# EAGLE design DAC_1_0 (EAGLE 7.6.0)
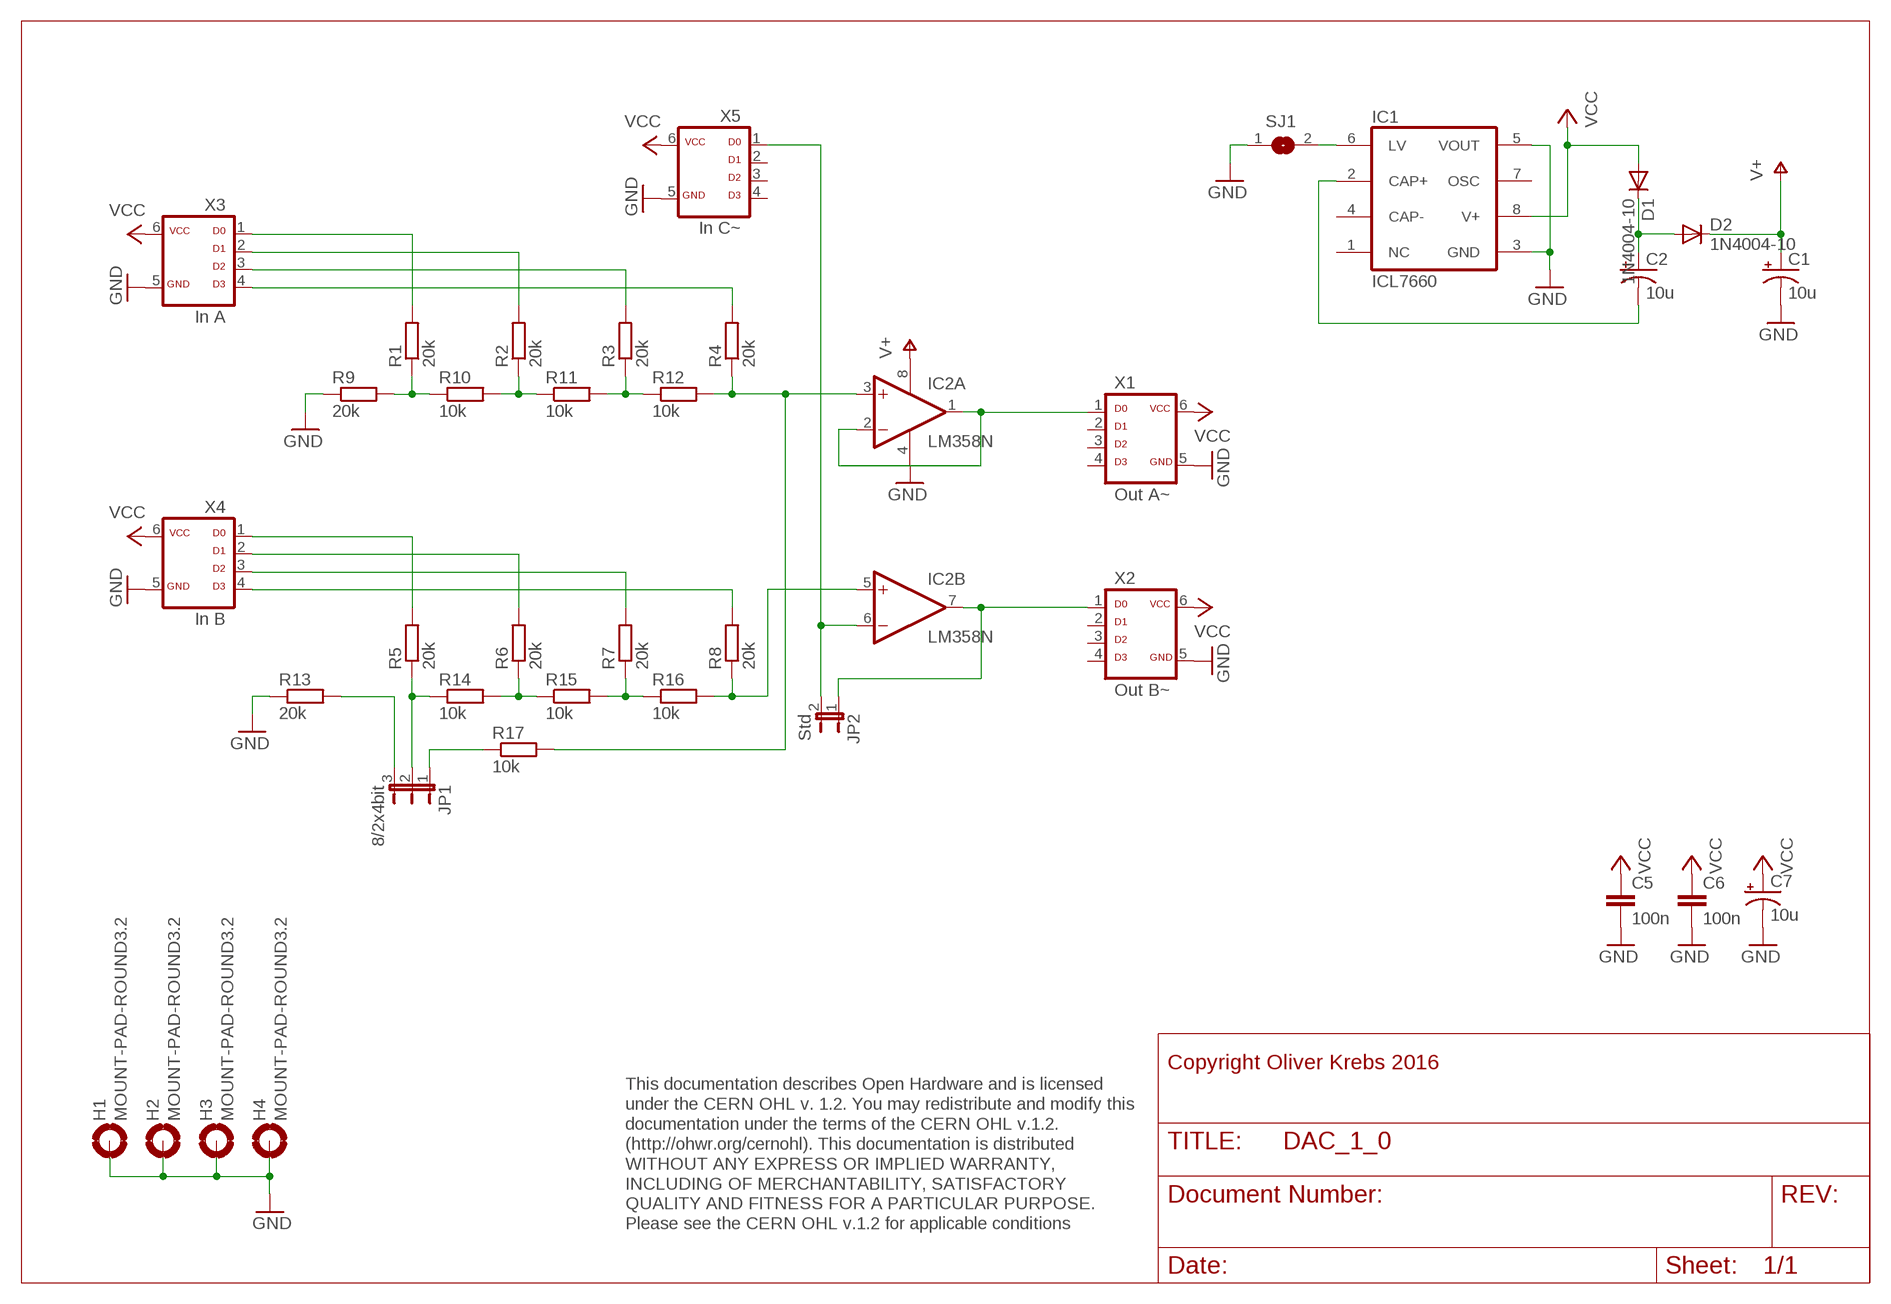
[diagram p0: schematic, sheet 1]

## Parts
C1  10u  CAP_POLPTH2  [CPOL-RADIAL-10UF-25V]
C2  10u  CAP_POLPTH2  [CPOL-RADIAL-10UF-25V]
C5  100n  CAPPTH1  [CAP-PTH-5MM]
C6  100n  CAPPTH1  [CAP-PTH-5MM]
C7  10u  CAP_POLPTH2  [CPOL-RADIAL-10UF-25V]
D1  1N4004-10  [DO41-10]
D2  1N4004-10  [DO41-10]
H1  MOUNT-PAD-ROUND3.2  [3,2-PAD]
H2  MOUNT-PAD-ROUND3.2  [3,2-PAD]
H3  MOUNT-PAD-ROUND3.2  [3,2-PAD]
H4  MOUNT-PAD-ROUND3.2  [3,2-PAD]
IC1  ICL7660  ICL7660CPA  [DIL08]
IC2  LM358N  [DIL08]
JP1  8/2x4bit  JP2EJP2-U  [JP2-U]
JP2  Std  JP1E  [JP1]
R1  20k  R-EU_0207/2V  [0207/2V]
R2  20k  R-EU_0207/2V  [0207/2V]
R3  20k  R-EU_0207/2V  [0207/2V]
R4  20k  R-EU_0207/2V  [0207/2V]
R5  20k  R-EU_0207/2V  [0207/2V]
R6  20k  R-EU_0207/2V  [0207/2V]
R7  20k  R-EU_0207/2V  [0207/2V]
R8  20k  R-EU_0207/2V  [0207/2V]
R9  20k  R-EU_0207/2V  [0207/2V]
R10  10k  R-EU_0207/2V  [0207/2V]
R11  10k  R-EU_0207/2V  [0207/2V]
R12  10k  R-EU_0207/2V  [0207/2V]
R13  20k  R-EU_0207/2V  [0207/2V]
R14  10k  R-EU_0207/2V  [0207/2V]
R15  10k  R-EU_0207/2V  [0207/2V]
R16  10k  R-EU_0207/2V  [0207/2V]
R17  10k  R-EU_0207/2V  [0207/2V]
SJ1  SJ  [SJ]
X1  Out A~  ML6D  [ML-6]
X2  Out B~  ML6D  [ML-6]
X3  In A  ML6D  [ML-6]
X4  In B  ML6D  [ML-6]
X5  In C~  ML6D  [ML-6]

## Nets
GND: C1.2(-) C5.2 C6.2 C7.2(-) H1.B3,2(MOUNT) H2.B3,2(MOUNT) H3.B3,2(MOUNT) H4.B3,2(MOUNT) IC1.3(GND) IC1.5(VOUT) IC2.4(P:V-) R9.1 R13.1 SJ1.1 X1.5 X2.5 X3.5 X4.5 X5.5
N$1: R1.2 X3.1
N$2: R2.2 X3.2
N$3: R3.2 X3.3
N$4: R4.2 X3.4
N$5: C2.2(-) IC1.2(CAP+)
N$6: C2.1(+) D1.C D2.A
N$7: R1.1 R9.2 R10.1
N$8: R2.1 R10.2 R11.1
N$9: R3.1 R11.2 R12.1
N$10: IC2.3(A:+IN) R4.1 R12.2 R17.2
N$11: R5.2 X4.1
N$12: R6.2 X4.2
N$13: R7.2 X4.3
N$14: R8.2 X4.4
N$15: JP1.2 R5.1 R14.1
N$16: R6.1 R14.2 R15.1
N$17: R7.1 R15.2 R16.1
N$18: IC2.5(B:+IN) R8.1 R16.2
N$19: JP1.3 R13.2
N$21: IC2.1(A:OUT) IC2.2(A:-IN) X1.1
N$22: IC2.7(B:OUT) JP2.1 X2.1
N$23: JP1.1 R17.1
N$24: IC1.6(LV) SJ1.2
N$25: IC2.6(B:-IN) JP2.2 X5.1
V+: C1.1(+) D2.C IC2.8(P:V+)
VCC: C5.1 C6.1 C7.1(+) D1.A IC1.8(V+) X1.6 X2.6 X3.6 X4.6 X5.6
Unconnected: IC1.1(NC) IC1.4(CAP-) IC1.7(OSC) X1.2 X1.3 X1.4 X2.2 X2.3 X2.4 X5.2 X5.3 X5.4

## Notes on the sheet
- Copyright Oliver Krebs 2016
- This documentation describes Open Hardware and is licensed 
  under the CERN OHL v. 1.2. You may redistribute and modify this 
  documentation under the terms of the CERN OHL v.1.2. 
  (http://ohwr.org/cernohl). This documentation is distributed
  WITHOUT ANY EXPRESS OR IMPLIED WARRANTY, 
  INCLUDING OF MERCHANTABILITY, SATISFACTORY 
  QUALITY AND FITNESS FOR A PARTICULAR PURPOSE. 
  Please see the CERN OHL v.1.2 for applicable conditions

## Library data of the parts
C1 C2 C7 = SparkFun-Passives:CAP_POL: Capacitor Polarized These are standard SMD and PTH capacitors. Normally 10uF, 47uF, and 100uF in electrolytic and tantalum varieties. Always verify the external diameter of the through hole cap, it varies with capacity, voltage, and manufacturer. The EIA devices should be standard.
C5 C6 = SparkFun-Passives:CAP: Capacitor Standard 0603 ceramic capacitor, and 0.1" leaded capacitor.
D1 D2 = 01-my-diode:1N4004: DIODE general purpose rectifier, 1 A
H1-H4 = holes:MOUNT-PAD-ROUND: MOUNTING PAD, round
IC1 = maxim:ICL7660CPA: VOLTAGE CONVERTER; MF: INTERSIL; MPN: ICL7660CPA; OC_FARNELL: 1018170; OC_NEWARK: 06F7441
IC2 = 01-my-linear:LM358: OP AMP also LM158; LM258; LM2904 Source: http://cache.national.com/ds/LM/LM158.pdf
JP1 = 01-my-jumper:JP2E: JUMPER
JP2 = jumper:JP1E: JUMPER
R1-R17 = 01-my_rcl:R-EU_: RESISTOR, European symbol
SJ1 = jumper:SJ: SMD solder JUMPER
X1-X5 = 01-my-con:ML6D

## Board
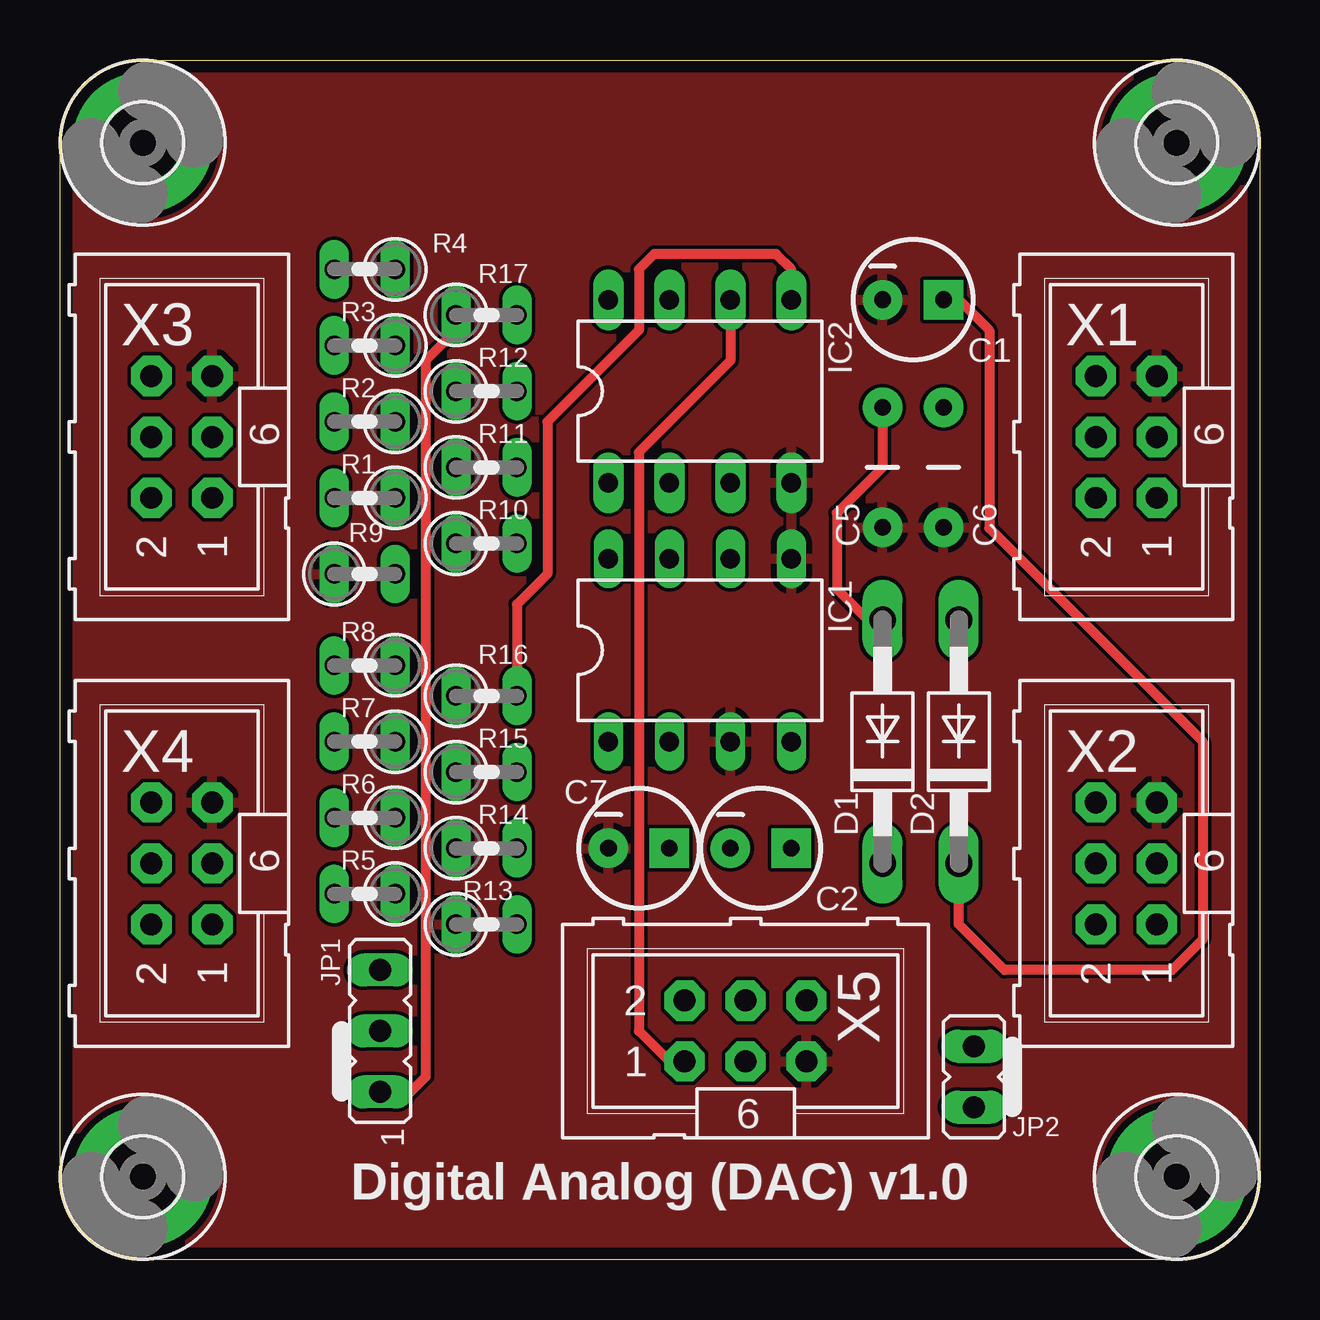
[diagram p1: board, top side]
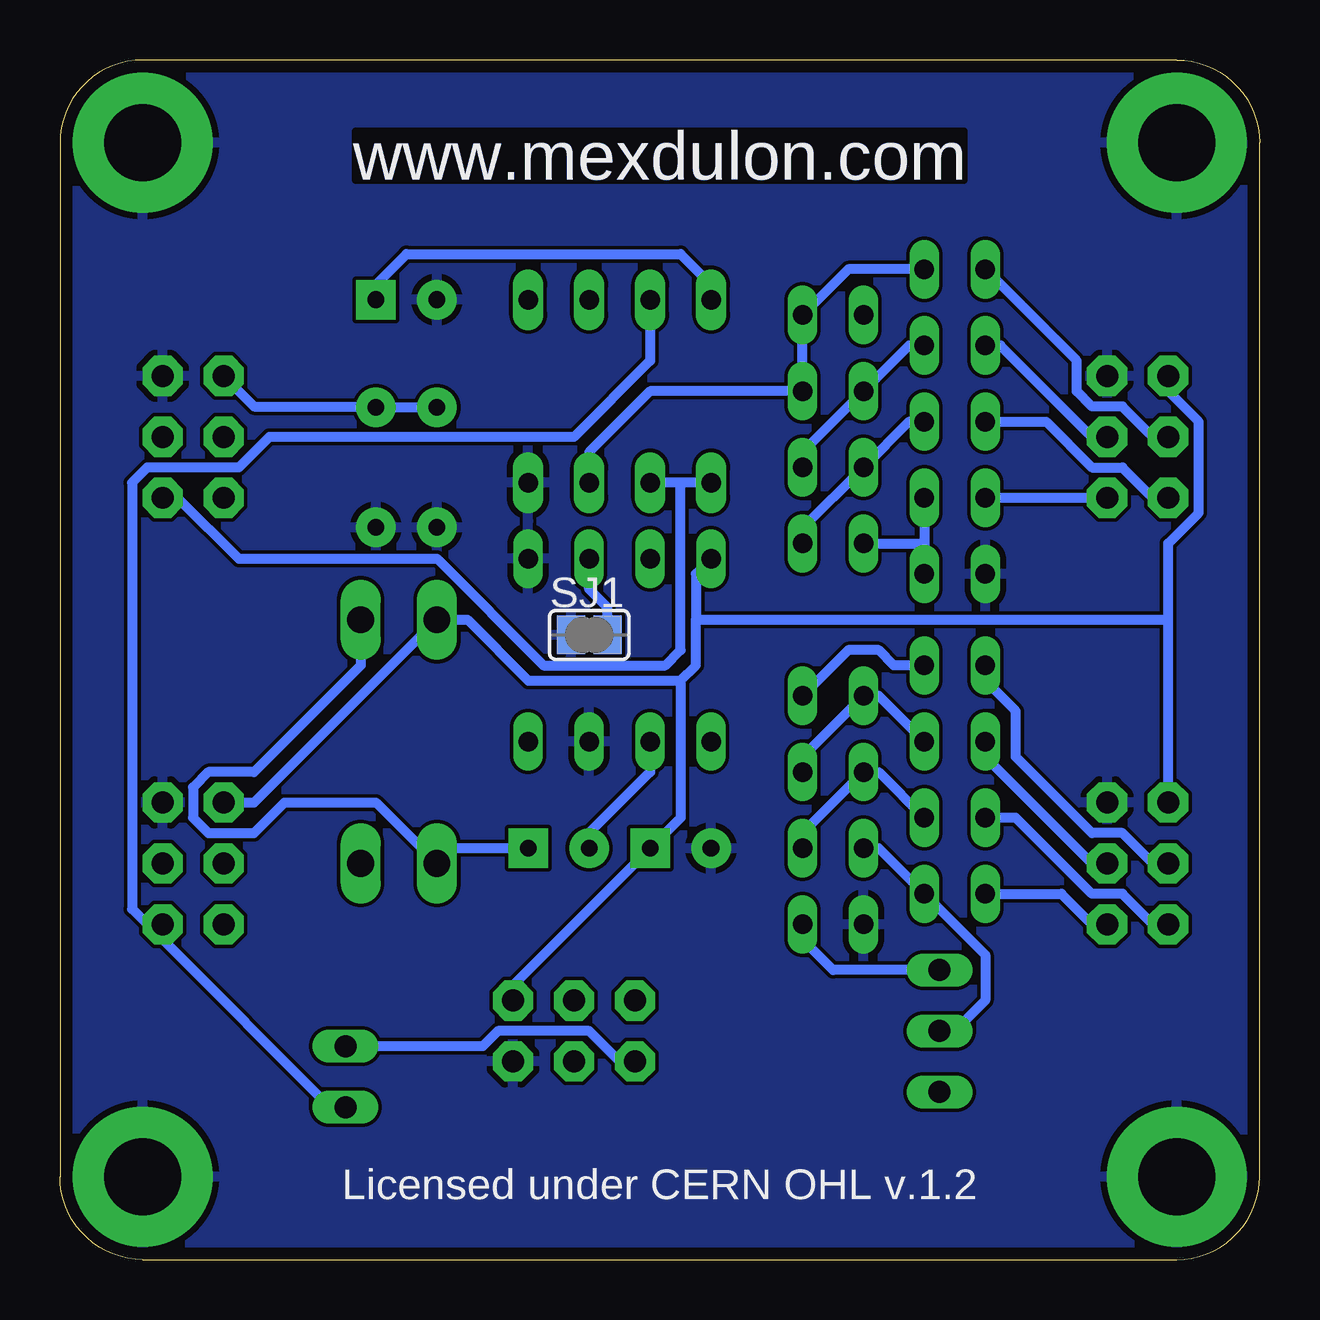
[diagram p2: board, bottom side, seen from below]

Size 50 x 50 mm. Coordinates in mm from the lower left corner, seen from the top.
Outline: 0,3.45 0,46.55 arc-90 3.45,50 46.55,50 arc-90 50,46.55 50,3.45 arc-90 46.55,0 3.45,0 arc-90 0,3.45
Copper layers (1*16): Top 0.035mm / dielectric 1.6mm / Bottom 0.035mm
Design rules "Elecrow_2-layer_PCB_eagle_rule": minimum track width 6mil, minimum drill 12mil, track to track 6mil, track to pad 6mil, pad to pad 6mil, via to via 8mil, smd to smd 0mil, copper to edge 20mil, drill to drill 10mil, minimum pad ring 6mil, minimum via ring 6mil, stop-mask expansion 0mil, vias tented up to drill 100mil, thermal gap 10mil

### Footprints (pad centres in the part's own frame; a part is rotated, then mirrored left to right if it is on the bottom)
CPOL-RADIAL-10UF-25V = drill 0.7 pad 1.651 square: 1 1.27,0 | drill 0.7 pad 1.651: 2 -1.27,0
CAP-PTH-5MM = drill 0.7 pad 1.651: 1 -2.5,0; 2 2.5,0
DO41-10 = drill 1.118 long: A 5.08,0; C -5.08,0
3,2-PAD = drill 3.2 pad 5.842: B3,2 0,0
DIL08 = drill 0.813 long: 1 -3.81,-3.81; 2 -1.27,-3.81; 3 1.27,-3.81; 4 3.81,-3.81; 5 3.81,3.81; 6 1.27,3.81; 7 -1.27,3.81; 8 -3.81,3.81
DIL08' = drill 0.813 pad 1.27 long: 1 -3.81,-3.81; 2 -1.27,-3.81; 3 1.27,-3.81; 4 3.81,-3.81; 5 3.81,3.81; 6 1.27,3.81; 7 -1.27,3.81; 8 -3.81,3.81
JP2-U = drill 0.914 long: 1 -2.54,0; 2 0,0; 3 2.54,0
JP1 = drill 0.914 long: 1 0,-1.27; 2 0,1.27
0207/2V = drill 0.813 long: 1 -1.27,0; 2 1.27,0
SJ = smd 1.168 x 1.6: 1 -0.762,0; 2 0.762,0
ML-6 = drill 0.914 pad 1.676 octagon: 1 -2.54,-1.27; 2 -2.54,1.27; 3 0,-1.27; 4 0,1.27; 5 2.54,-1.27; 6 2.54,1.27

### Placement (x,y rotation side)
C1  35.56,40.01 0 top
C2  29.21,17.14 0 top
C5  34.29,33.02 270 top
C6  36.83,33.02 270 top
C7  24.13,17.14 0 top
D1  34.29,21.59 90 top
D2  37.47,21.59 90 top
H1  3.45,3.45 0 top
H2  3.45,46.55 0 top
H3  46.55,3.45 0 top
H4  46.55,46.55 0 top
IC1  26.67,25.4 0 top
IC2  LM358N  [DIL08']  26.67,36.2 0 top
JP1  13.34,9.53 90 top
JP2  38.1,7.62 0 top
R1  12.7,31.75 180 top
R2  12.7,34.92 180 top
R3  12.7,38.1 180 top
R4  12.7,41.27 180 top
R5  12.7,15.24 180 top
R6  12.7,18.41 180 top
R7  12.7,21.59 180 top
R8  12.7,24.77 180 top
R9  12.7,28.57 0 top
R10  17.78,29.84 0 top
R11  17.78,33.02 0 top
R12  17.78,36.2 0 top
R13  17.78,13.97 0 top
R14  17.78,17.14 0 top
R15  17.78,20.32 0 top
R16  17.78,23.5 0 top
R17  17.78,39.37 0 top
SJ1  27.94,26.04 0 bottom
X1  44.45,34.29 90 top
X2  44.45,16.51 90 top
X3  5.08,34.29 90 top
X4  5.08,16.51 90 top
X5  28.57,9.53 0 top

### Tracks (layer width: path | path; a pad name or v marks a point on that pad's centre or on a via)
GND
  pour Bottom: 0,0 50.8,0 50.8,50.8 0,50.8
  pour Top: 0,50.16 50.16,50.16 50.16,0 0,0
N$1
  Bottom 0.406: X3.1 R1.2
N$2
  Bottom 0.406: R2.2 8.89,34.92 6.99,33.02 5.71,33.02 4.45,31.75 X3.2
N$3
  Bottom 0.406: R3.2 10.79,38.1 6.99,34.29 X3.3
N$4
  Bottom 0.406: X3.4 4.45,34.29 5.71,35.56 6.99,35.56 7.62,36.2 7.62,37.47 R4.2
N$5
  Bottom 0.406: IC1.2 25.4,20.32 27.94,17.78 C2.2
N$6
  Bottom 0.406: C2.1 33.66,17.14 D1.C 36.83,19.05 40.64,19.05 41.91,17.78 43.81,17.78 44.45,18.41 44.45,19.68 43.81,20.32 41.91,20.32 37.47,24.77 D2.A
N$7
  Bottom 0.406: R1.1 13.97,29.84 | 13.97,29.84 R9.2 | R10.1 13.97,29.84
N$8
  Bottom 0.406: R2.1 14.61,34.92 R11.1 19.05,30.48 R10.2
N$9
  Bottom 0.406: R3.1 14.61,38.1 R12.1 19.05,33.66 R11.2
N$10
  Bottom 0.406: R4.1 17.14,41.27 R17.2 R12.2 25.4,36.2 27.94,33.66 IC2.3
N$11
  Bottom 0.406: R5.2 8.26,15.24 6.99,13.97 X4.1
N$12
  Bottom 0.406: X4.2 4.45,13.97 5.71,15.24 6.99,15.24 10.16,18.41 R6.2
N$13
  Bottom 0.406: X4.3 6.99,16.51 11.43,20.95 R7.2
N$14
  Bottom 0.406: X4.4 4.45,16.51 5.71,17.78 6.99,17.78 10.16,20.95 10.16,22.86 11.43,24.13 R8.2
N$15
  Bottom 0.406: R14.1 15.88,17.14 R5.1 11.43,12.7 11.43,10.79 12.7,9.53 JP1.2
N$16
  Bottom 0.406: R6.1 15.88,20.32 R15.1 19.05,17.78 R14.2
N$17
  Bottom 0.406: R7.1 15.88,23.5 R16.1 19.05,20.95 R15.2
N$18
  Top 0.406: IC2.5 30.48,41.27 29.84,41.91 24.77,41.91 24.13,41.27 24.13,38.73 20.32,34.92 20.32,28.57 19.05,27.3 R16.2
  Bottom 0.406: R8.1 15.24,24.77 15.88,25.4 17.14,25.4 R16.2
N$19
  Bottom 0.406: JP1.3 17.78,12.06 19.05,13.34 R13.2
N$21
  Bottom 0.406: IC2.1 24.13,32.38 | 24.13,32.38 IC2.2 | X1.1 45.09,31.75 42.55,29.21 34.29,29.21 29.84,24.77 24.77,24.77 24.13,25.4 24.13,32.38
N$22
  Bottom 0.406: JP2.1 38.73,6.35 45.72,13.34 | 45.72,13.34 X2.1 | IC2.7 25.4,37.47 28.57,34.29 41.27,34.29 42.55,33.02 46.35,33.02 46.99,32.38 46.99,14.61 45.72,13.34
N$23
  Top 0.406: R17.1 16.51,38.73 15.24,37.47 15.24,7.62 14.61,6.99 JP1.1
N$24
  Bottom 0.406: SJ1.2 27.18,27.18 27.94,27.94 IC1.6
N$25
  Top 0.406: IC2.6 27.94,37.47 24.13,33.66 24.13,9.53 25.4,8.26 X5.1
  Bottom 0.406: X5.1 26.67,8.26 27.94,9.53 31.75,9.53 32.38,8.89 JP2.2
V+
  Top 0.406: C1.1 37.47,40.01 38.73,38.73 38.73,30.48 47.62,21.59 47.62,13.34 46.35,12.06 39.37,12.06 37.47,13.97 D2.C
  Bottom 0.406: C1.1 36.83,40.64 35.56,41.91 24.13,41.91 22.86,40.64 IC2.8
VCC
  Top 0.406: C5.1 34.29,33.02 32.38,31.11 32.38,27.94 33.66,26.67 D1.A
  Bottom 0.406: X4.6 3.81,26.67 | 3.81,26.67 3.81,29.84 2.54,31.11 2.54,34.92 3.81,36.2 X3.6 | C5.1 C6.1 36.87,35.56 41.91,35.56 X1.6 | 24.13,24.13 30.48,24.13 33.02,26.67 D1.A 41.91,19.05 X2.6 | 24.13,24.13 23.5,24.77 23.5,26.67 | 23.5,26.67 3.81,26.67 | 24.13,24.13 24.13,18.41 C7.1 31.11,11.43 X5.6 | IC1.8 23.5,28.57 23.5,26.67

### Text on the board
Bottom: www.mexdulon.com
tNames: Digital Analog (DAC) v1.0
bNames: www.mexdulon.com | Licensed under CERN OHL v.1.2